# Altium schematic sheet LapTopBoard.SchDoc
size A
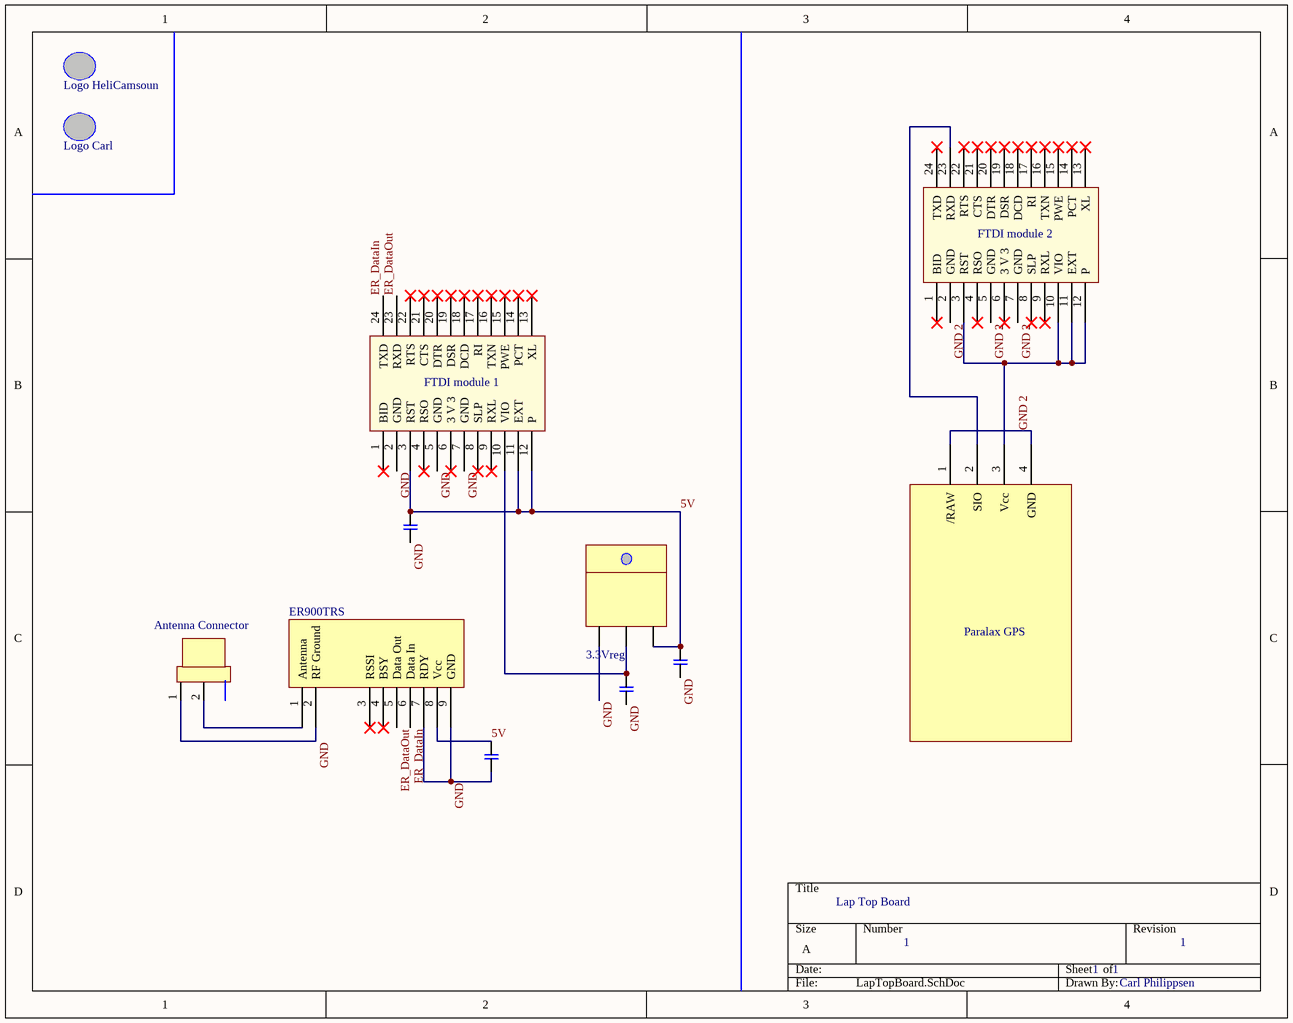
[diagram p0: LapTopBoard.SchDoc]

## Parts
2mmCap_1  2mmCap  [2mmCap]  (value not drawn)
2mmCap_2  2mmCap  [2mmCap]  (value not drawn)
2mmCap_3  2mmCap  [2mmCap]  (value not drawn)
2mmCap_4  2mmCap  [2mmCap]  (value not drawn)
3.3Vreg  3.3Vreg  [3.3Vreg]  (value not drawn)
Antenna_Connector  Antenna Connector  [Antenna Connector]  (value not drawn)
ER900TRS  Easy Radio 900MHz  [ER900TRS]  (value not drawn)
FTDI_module_1  FTDI module  [FTDI module]  (value not drawn)
FTDI_module_2  FTDI module  [FTDI module]  (value not drawn)
Logo_Carl  logo  [Carl Logo]  (value not drawn)
Logo_HeliCamsoun  logo  [HeliCamosun]  (value not drawn)
Paralax_GPS  Paralax GPS  [Paralax GPS]  (value not drawn)

## Nets
5V: 2mmCap_1.1 2mmCap_3.1 2mmCap_4.1 3.3Vreg.3 ER900TRS.8(Vcc) FTDI_module_1.3(RST) FTDI_module_1.11(EXT) FTDI_module_1.12(P)
ER_DataIn: ER900TRS.6(Data_In) FTDI_module_1.24(TXD)
ER_DataOut: ER900TRS.5(Data_Out) FTDI_module_1.23(RXD)
GND: 2mmCap_1.2 2mmCap_2.2 2mmCap_3.2 2mmCap_4.2 3.3Vreg.1 Antenna_Connector.1 ER900TRS.2(RF_Ground) ER900TRS.7(RDY) ER900TRS.9(GND) FTDI_module_1.2(GND) FTDI_module_1.5(GND) FTDI_module_1.7(GND)
GND 2: FTDI_module_2.2(GND) FTDI_module_2.5(GND) FTDI_module_2.7(GND) Paralax_GPS.1(/RAW) Paralax_GPS.4(GND)
Net2mmCap_2_1: 2mmCap_2.1 3.3Vreg.2 FTDI_module_1.10(VIO)
NetAntenna_Connector_2: Antenna_Connector.2 ER900TRS.1(Antenna)
NetFTDI_module_2_3: FTDI_module_2.3(RST) FTDI_module_2.10(VIO) FTDI_module_2.11(EXT) FTDI_module_2.12(P) Paralax_GPS.3(Vcc)
NetFTDI_module_2_23: FTDI_module_2.23(RXD) Paralax_GPS.2(SIO)

Not connected (* = marked no-connect by the designer): ER900TRS 3(RSSI)* 4(BSY)*; FTDI_module_1 1(BID)* 4(RSO)* 6(3_V_3)* 8(SLP)* 9(RXL)* 13(XL)* 14(PCT)* 15(PWE)* 16(TXN)* 17(RI)* 18(DCD)* 19(DSR)* 20(DTR)* 21(CTS)* 22(RTS)*; FTDI_module_2 1(BID)* 4(RSO)* 6(3_V_3)* 8(SLP)* 9(RXL)* 13(XL)* 14(PCT)* 15(PWE)* 16(TXN)* 17(RI)* 18(DCD)* 19(DSR)* 20(DTR)* 21(CTS)* 22(RTS)* 24(TXD)*

## Notes on the sheet
- Lap Top Board
- 1
- Carl Philippsen

## Library data of the parts
ER900TRS = ER900TRS